# EAGLE schematic FIDO2AUTH_001 (EAGLE 7.7.0)

## Sheet 1 of 3
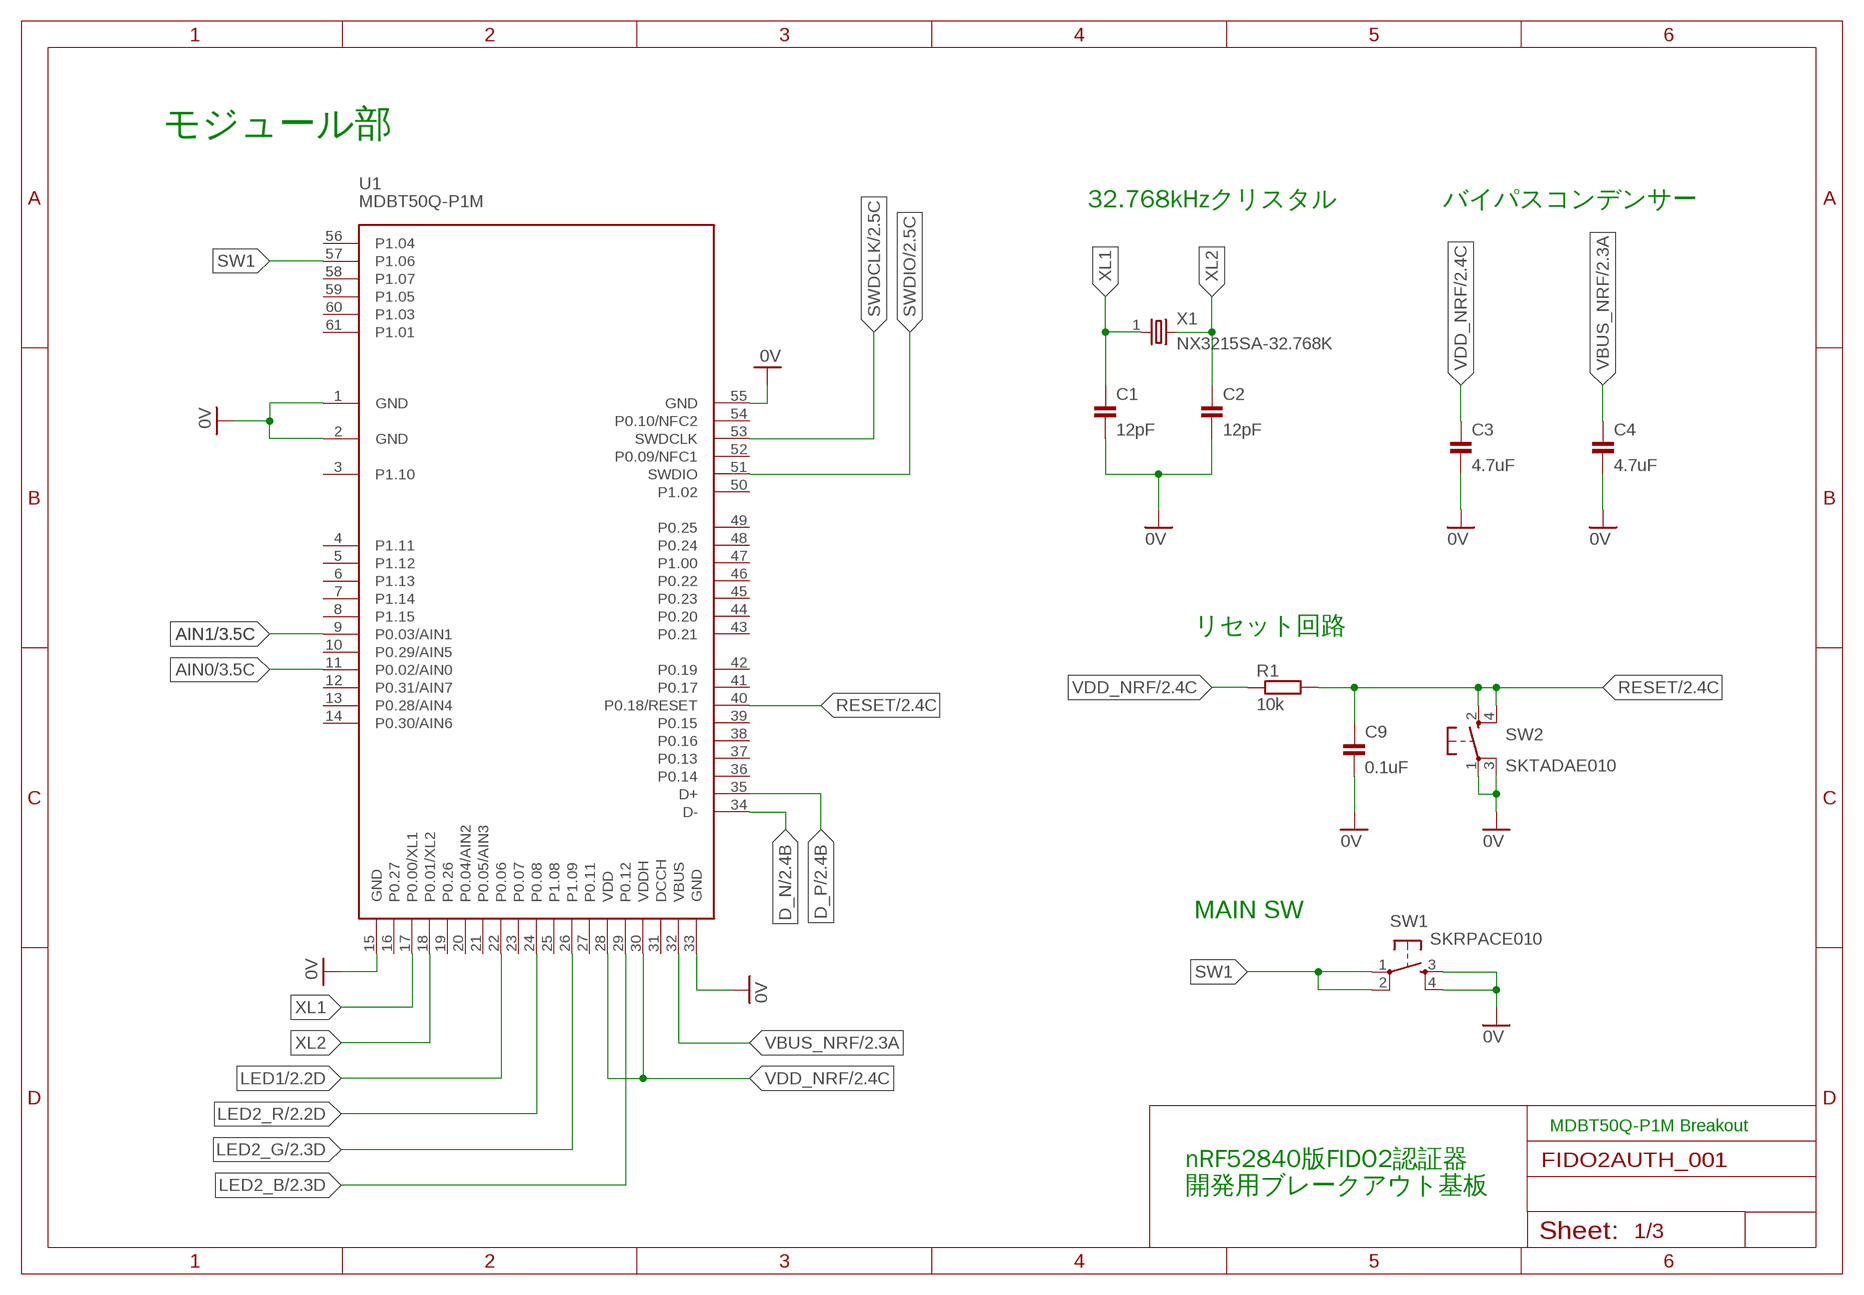
[diagram p0: schematic, sheet 1]

### Parts
C1  12pF  CAP_0603  [C0603K]
C2  12pF  CAP_0603  [C0603K]
C3  4.7uF  CAP_0603  [C0603K]
C4  4.7uF  CAP_0603  [C0603K]
C9  0.1uF  CAP_0603  [C0603K]
R1  10k  RESISTOR_0603  [R0603]
SW1  SKRPACE010  [SKRPACE010]
SW2  SKTADAE010  [SKTADAE010]
U1  MDBT50Q-P1M  [MDBT50Q-P1M]
X1  NX3215SA-32.768K  [NX3215]

### Nets
0V: C1.2 C2.2 C3.2 C4.2 C9.2 SW1.3(S) SW1.4(S1) SW2.1(P) SW2.3(P1) U1.1(GND) U1.2(GND) U1.15(GND) U1.33(GND) U1.55(GND) ; also sheet 2,3
AIN0: U1.11(P0.02/AIN0) ; also sheet 3
AIN1: U1.9(P0.03/AIN1) ; also sheet 3
D_N: U1.34(D-) ; also sheet 2
D_P: U1.35(D+) ; also sheet 2
LED1: U1.22(P0.06) ; also sheet 2
LED2_B: U1.29(P0.12) ; also sheet 2
LED2_G: U1.26(P1.09) ; also sheet 2
LED2_R: U1.24(P0.08) ; also sheet 2
RESET: C9.1 R1.2 SW2.2(S) SW2.4(S1) U1.40(P0.18/RESET) ; also sheet 2
SW1: SW1.1(P) SW1.2(P1) U1.57(P1.06)
SWDCLK: U1.53(SWDCLK) ; also sheet 2
SWDIO: U1.51(SWDIO) ; also sheet 2
VBUS_NRF: C4.1 U1.32(VBUS) ; also sheet 2,3
VDD_NRF: C3.1 R1.1 U1.28(VDD) U1.30(VDDH) ; also sheet 2,3
XL1: C1.1 U1.17(P0.00/XL1) X1.1
XL2: C2.1 U1.18(P0.01/XL2) X1.2
Unconnected: U1.3(P1.10) U1.4(P1.11) U1.5(P1.12) U1.6(P1.13) U1.7(P1.14) U1.8(P1.15) U1.10(P0.29/AIN5) U1.12(P0.31/AIN7) U1.13(P0.28/AIN4) U1.14(P0.30/AIN6) U1.16(P0.27) U1.19(P0.26) U1.20(P0.04/AIN2) U1.21(P0.05/AIN3) U1.23(P0.07) U1.25(P1.08) U1.27(P0.11) U1.31(DCCH) U1.36(P0.14) U1.37(P0.13) U1.38(P0.16) U1.39(P0.15) U1.41(P0.17) U1.42(P0.19) U1.43(P0.21) U1.44(P0.20) U1.45(P0.23) U1.46(P0.22) U1.47(P1.00) U1.48(P0.24) U1.49(P0.25) U1.50(P1.02) U1.52(P0.09/NFC1) U1.54(P0.10/NFC2) U1.56(P1.04) U1.58(P1.07) U1.59(P1.05) U1.60(P1.03) U1.61(P1.01)

### Notes on the sheet
- モジュール部
- 32.768kHzクリスタル | バイパスコンデンサー
- リセット回路
- MAIN SW
- MDBT50Q-P1M Breakout
- nRF52840版FIDO2認証器
  開発用ブレークアウト基板

## Sheet 2 of 3
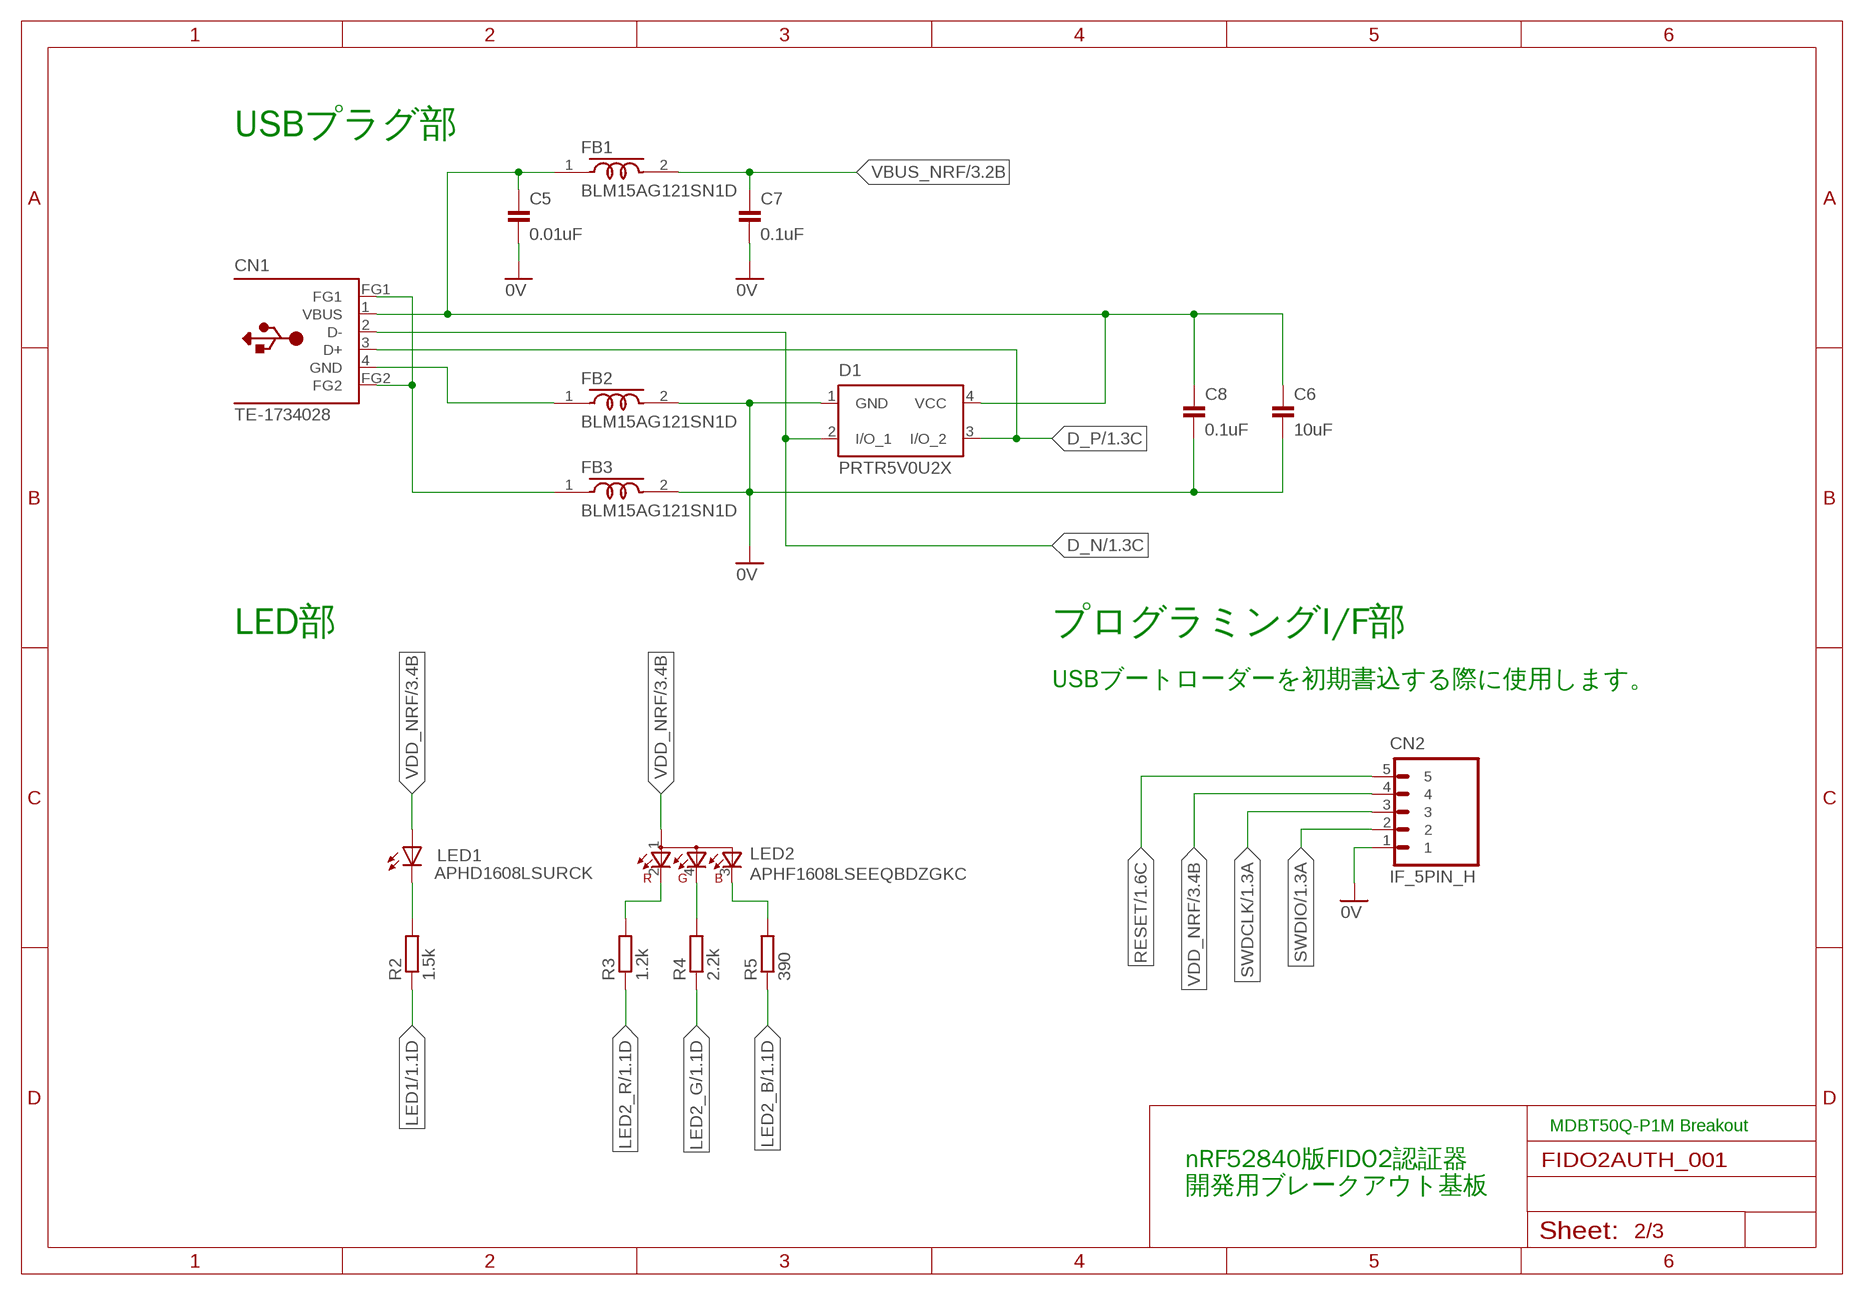
[diagram p1: schematic, sheet 2]

### Parts
C5  0.01uF  CAP_0603  [C0603K]
C6  10uF  CAP_0603  [C0603K]
C7  0.1uF  CAP_0603  [C0603K]
C8  0.1uF  CAP_0603  [C0603K]
CN1  TE-1734028  [TE-1734028]
CN2  IF_5PIN_H  [HEADER_5PIN]
D1  PRTR5V0U2X  [SOT143B]
FB1  BLM15AG121SN1D  [C0402K@1]
FB2  BLM15AG121SN1D  [C0402K@1]
FB3  BLM15AG121SN1D  [C0402K@1]
LED1  APHD1608LSURCK  [CHIPLED_0603]
LED2  APHF1608LSEEQBDZGKC  [APHF1608LSEEQBDZGKC]
R2  1.5k  RESISTOR_0603  [R0603]
R3  1.2k  RESISTOR_0603  [R0603]
R4  2.2k  RESISTOR_0603  [R0603]
R5  390  RESISTOR_0603  [R0603]

### Nets
0V: C5.2 C6.2 C7.2 C8.2 CN2.1 D1.1(GND) FB2.2 FB3.2 ; also sheet 1,3
D_N: CN1.2(D-) D1.2(I/O_1) ; also sheet 1
D_P: CN1.3(D+) D1.3(I/O_2) ; also sheet 1
LED1: R2.1 ; also sheet 1
LED2_B: R5.1 ; also sheet 1
LED2_G: R4.1 ; also sheet 1
LED2_R: R3.1 ; also sheet 1
N$1: LED2.2(CRED) R3.2
N$2: CN1.4(GND) FB2.1
N$3: CN1.FG1 CN1.FG2 FB3.1
N$6: LED2.4(CGREEN) R4.2
N$7: LED2.3(CBLUE) R5.2
N$11: LED1.C R2.2
RESET: CN2.5 ; also sheet 1
SWDCLK: CN2.3 ; also sheet 1
SWDIO: CN2.2 ; also sheet 1
VBUS: C5.1 C6.1 C8.1 CN1.1(VBUS) D1.4(VCC) FB1.1
VBUS_NRF: C7.1 FB1.2 ; also sheet 1,3
VDD_NRF: CN2.4 LED1.A LED2.1(A) ; also sheet 1,3

### Notes on the sheet
- USBプラグ部
- LED部 | プログラミングI/F部
- USBブートローダーを初期書込する際に使用します。
- MDBT50Q-P1M Breakout
- nRF52840版FIDO2認証器
  開発用ブレークアウト基板

## Sheet 3 of 3
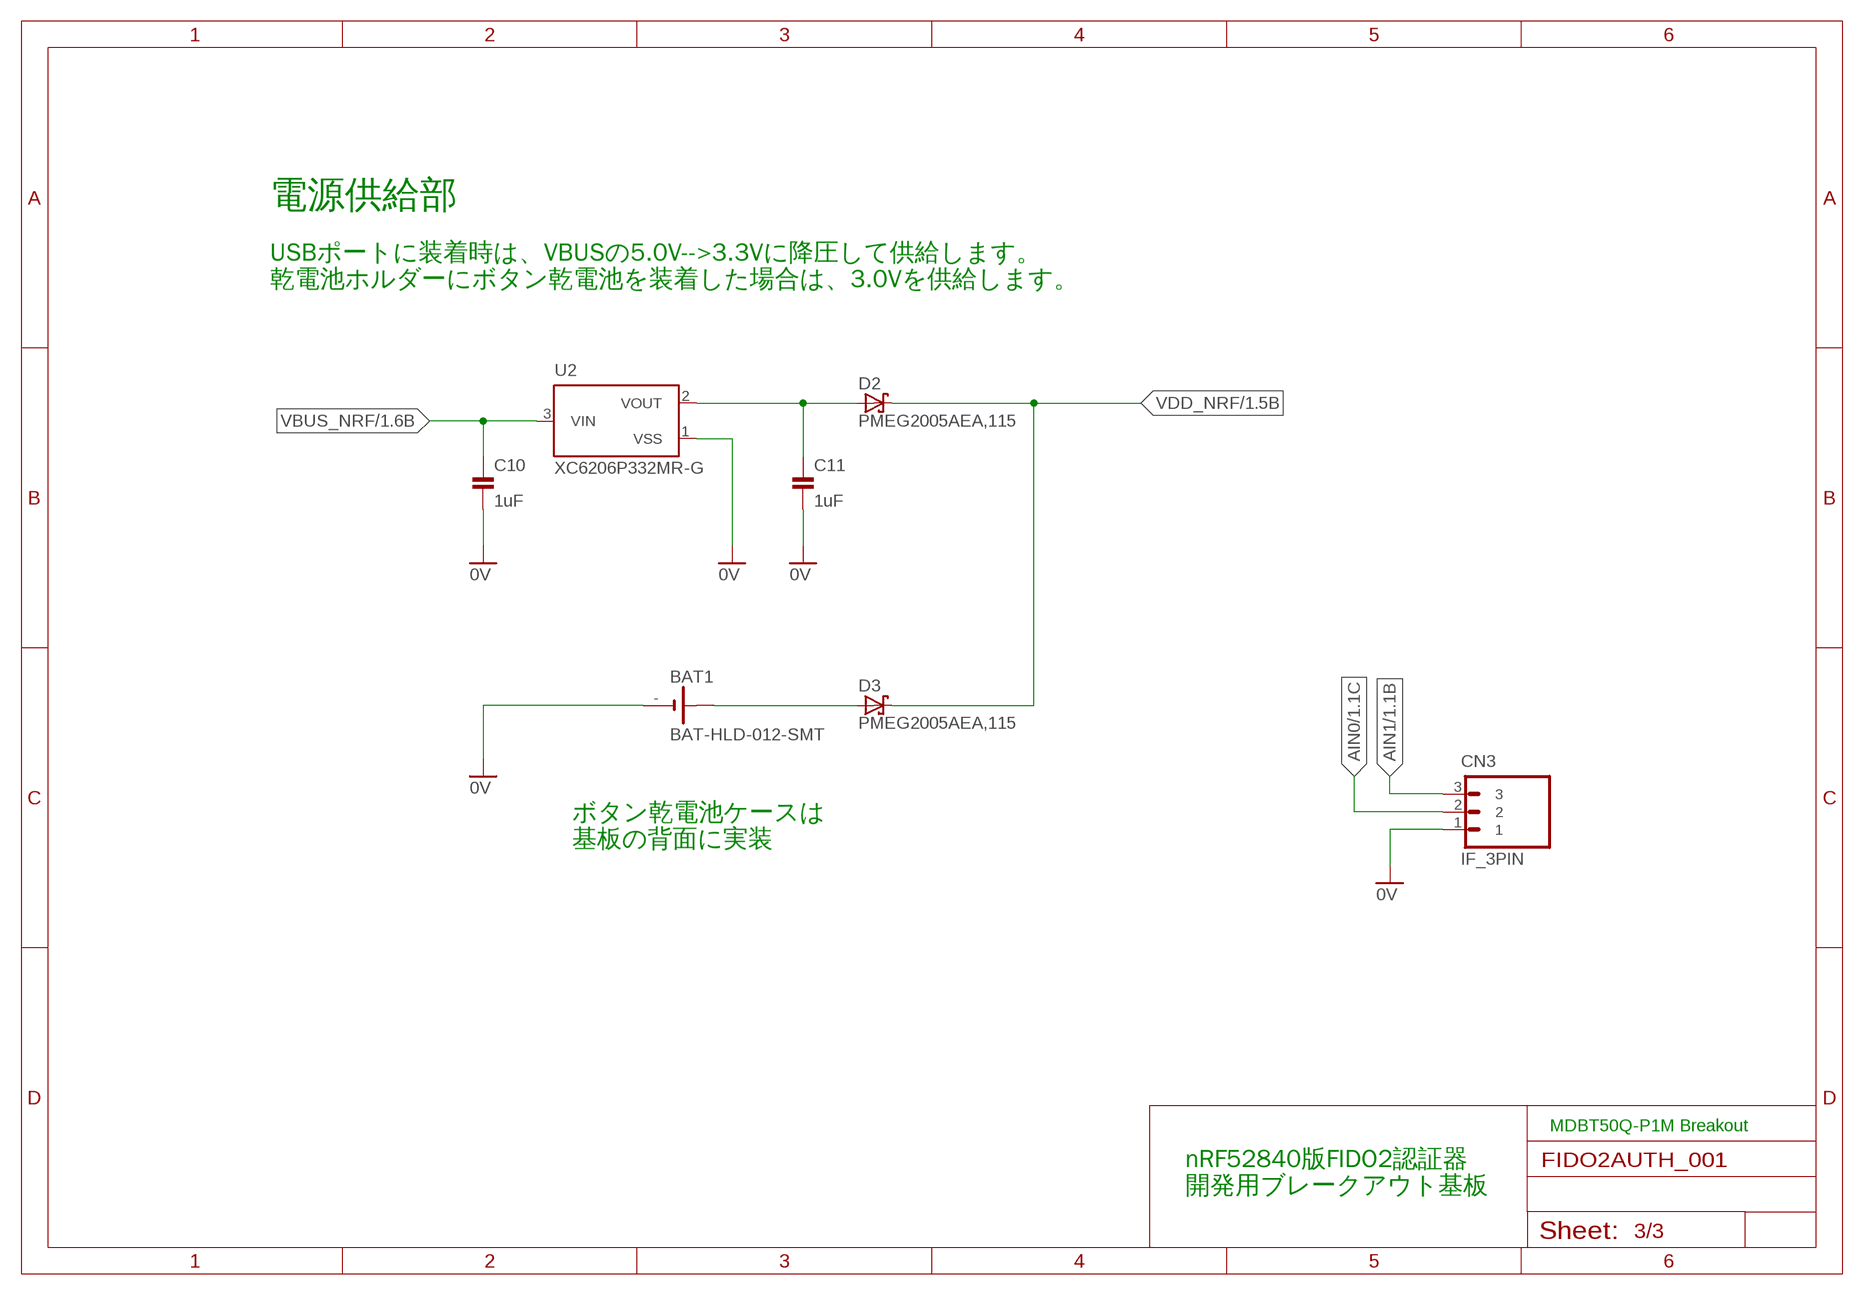
[diagram p2: schematic, sheet 3]

### Parts
BAT1  BAT-HLD-012-SMT  [BAT-HLD-012-SMT]
C10  1uF  CAP_0603  [C0603K]
C11  1uF  CAP_0603  [C0603K]
CN3  IF_3PIN  [HEADER_3PIN]
D2  PMEG2005AEA,115  [SOD323-W]
D3  PMEG2005AEA,115  [SOD323-W]
U2  XC6206P332MR-G  [SOT23]

### Nets
0V: BAT1.- C10.2 C11.2 CN3.1 U2.1(VSS) ; also sheet 1,2
AIN0: CN3.2 ; also sheet 1
AIN1: CN3.3 ; also sheet 1
N$4: C11.1 D2.A U2.2(VOUT)
N$5: BAT1.+@1(+) D3.A
VBUS_NRF: C10.1 U2.3(VIN) ; also sheet 1,2
VDD_NRF: D2.C D3.C ; also sheet 1,2

### Notes on the sheet
- 電源供給部
- USBポートに装着時は、VBUSの5.0V-->3.3Vに降圧して供給します。
  乾電池ホルダーにボタン乾電池を装着した場合は、3.0Vを供給します。
- ボタン乾電池ケースは
  基板の背面に実装
- MDBT50Q-P1M Breakout
- nRF52840版FIDO2認証器
  開発用ブレークアウト基板

## Library data of the parts
BAT1 = Connectors:BAT-HLD-012-SMT: ボタン電池ホルダー(CR1216/1225)
C1-C11 = Parts:CAP: コンデンサー
CN1 = Connectors:TE-1734028: USB connector plug TE Connectivity
CN2 = Connectors:IF_5PIN: 5-pin インターフェース
CN3 = Connectors:IF_3PIN: 3-pin インターフェース
D1 = Parts:PRTR5V0U2X: ESD protection diode
D2 D3 = Parts:PMEG2005: ショットキーダイオード If - 順電流: 500 mA Vrrm - 繰返し逆電圧: 20 V Vf - 順電圧: 0.39 V Ifsm - 順方向サージ電流: 10 A 最低動作温度: - 65 C 最高動作温度: + 150 C
FB1-FB3 = Parts:BLM15AG: フェライトビーズ EMIFIL®
LED1 = Parts:APHD1608: 発光ダイオード
LED2 = Parts:APHF1608: Chip LED RGB Source: http://document.sharpsma.com/files/GM1WA55311A_SS.pdf
R1-R5 = Parts:RESISTOR: 抵抗器
SW1 = Parts:SKRPACE010: 表面実装用タクトスイッチ ４．２×３．２ｍｍ小型重作動力タイプ ・作動力：２．５５Ｎ ・操作方向：垂直 ・移動量：０．２ｍｍ ・動作寿命：５０，０００ｃｙｃｌｅｓ （５ｍＡ ５ＶＤＣ） ・初期接触抵抗：最大５００ｍΩ
SW2 = Parts:SKTADAE010: 表面実装用タクトスイッチ 2.6×1.6ｍｍ小型重作動力タイプ ・作動力：2.4 N ・操作方向：垂直 ・移動量：0.11 mm ・定格：50 mA 12 VDC
U1 = Parts:MDBT50Q-P1M: MDBT50Q – P1M (PCB Antenna) Bluetooth 5, IEEE 802.15.4, 2.4 GHz transceiver ARM Cortex –M4 32-bit processor with FPU, 64 MHz Memory: 1MB flash / 256KB RAM ‧Supply voltage range 1.7V to 5.5V ‧On-chip DC/DC and LDO regulators with automated low current modes ‧Regulated supply for external components from 1.8V to 3.3V ‧0.4uA at 3V in System OFF mode, no RAM retention ‧1.5uA at 3V in System ON mode, no RAM retention, wake on RTC Working distance 1Mbps: up to 250 meters in open space 2Mbps: up to 120 meters in open space
U2 = Parts:XC6206: LDO電圧レギュレータ 出力電圧: 3.3 V 出力電流: 200 mA 入力電圧最大値: 6 V 最小入力電圧: 1.8 V 動作供給電流: 1 uA 最低動作温度: - 40 C 最高動作温度: + 85 C
X1 = Parts:NX3215SA: 水晶振動子 周波数 32.768kHz 周波数公差 ±20ppm 負荷容量 6pF ESR（等価直列抵抗） 70 kOhms 動作温度 -40°C～85°C